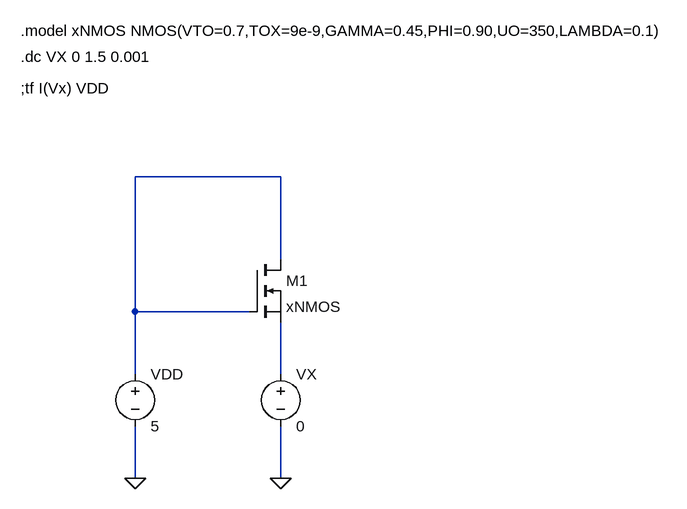
[diagram p0: schematic Homework2_5_a.asc]
Homework2_5_a.asc, the LTspice schematic file:
Version 4
SHEET 1 880 680
WIRE -128 -96 -352 -96
WIRE -128 32 -128 -96
WIRE -352 112 -352 -96
WIRE -176 112 -352 112
WIRE -352 208 -352 112
WIRE -128 208 -128 128
WIRE -352 368 -352 288
WIRE -128 368 -128 288
FLAG -352 368 0
FLAG -128 368 0
SYMBOL nmos -176 32 R0
SYMATTR InstName M1
SYMATTR Value xNMOS
SYMBOL voltage -352 192 R0
WINDOW 123 0 0 Left 0
WINDOW 39 0 0 Left 0
SYMATTR InstName VDD
SYMATTR Value 5
SYMBOL voltage -128 192 R0
WINDOW 123 0 0 Left 0
WINDOW 39 0 0 Left 0
SYMATTR InstName VX
SYMATTR Value 0
TEXT -528 -320 Left 2 !.model xNMOS NMOS(VTO=0.7,TOX=9e-9,GAMMA=0.45,PHI=0.90,UO=350,LAMBDA=0.1)
TEXT -528 -280 Left 2 !.dc VX 0 1.5 0.001
TEXT -528 -232 Left 2 !;tf I(Vx) VDD

The netlist it stands for:
* Homework2_5_a.asc
M1 N001 N001 N002 N002 xNMOS
VDD N001 0 5
VX N002 0 0
.model NMOS NMOS
.model PMOS PMOS
.lib standard.mos
.model xNMOS NMOS(VTO=0.7,TOX=9e-9,GAMMA=0.45,PHI=0.90,UO=350,LAMBDA=0.1)
.dc VX 0 1.5 0.001
;tf I(Vx) VDD
.backanno
.end